# Altium schematic sheet Sch_TrackCommanderCar_PowerPart.SchDoc
size 457 x 254 mm; SheetNumber: 1; SheetTotal: 3
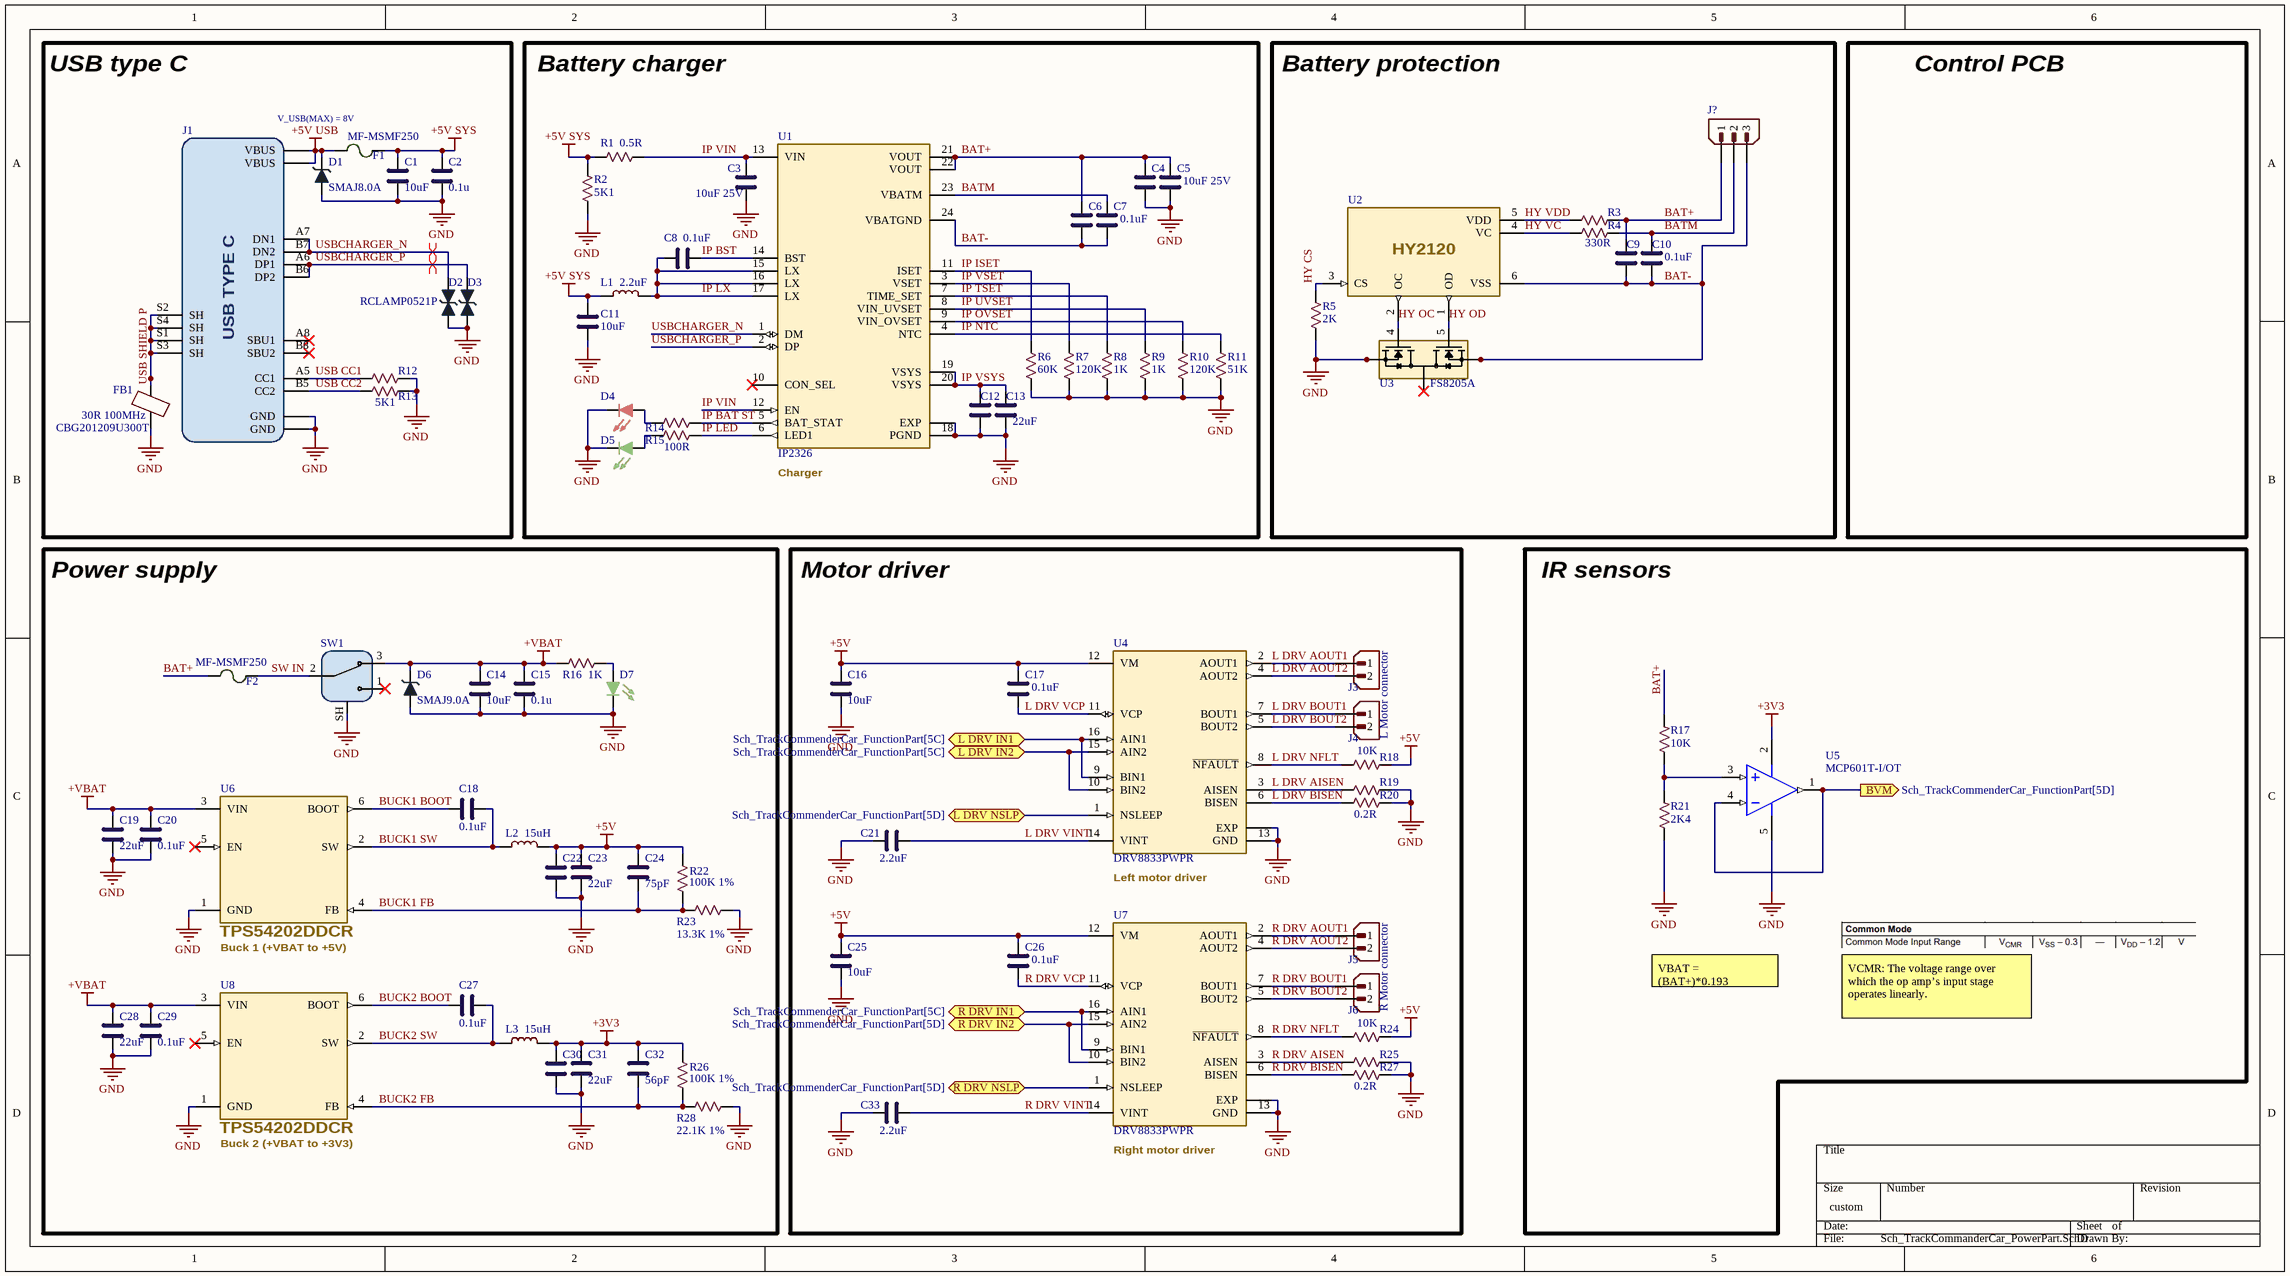
[diagram p0: Sch_TrackCommanderCar_PowerPart.SchDoc]

## Parts
C1  10uF  [C_1206]
C2  0.1u  [C_1206]
C3  10uF 25V  [C_0805]
C4  10uF 25V  [C_0805]  (value not drawn)
C5  10uF 25V  [C_0805]
C6  0.1uF  [C_0603]  (value not drawn)
C7  0.1uF  [C_0603]
C8  0.1uF  [C_0603]
C9  0.1uF  [C_0603]  (value not drawn)
C10  0.1uF  [C_0603]
C11  10uF  [C_1206]
C12  22uF  [C_0805]  (value not drawn)
C13  22uF  [C_0805]
C14  10uF  [C_1206]
C15  0.1u  [C_1206]
C16  10uF  [C_0805]
C17  0.1uF  [C_0603]
C18  0.1uF  [C_0603]
C19  22uF  [C_1206]
C20  0.1uF  [C_1206]
C21  2.2uF  [C_0805]
C22  22uF  [C_1210]  (value not drawn)
C23  22uF  [C_1210]
C24  75pF  [C_0603]
C25  10uF  [C_0805]
C26  0.1uF  [C_0603]
C27  0.1uF  [C_0603]
C28  22uF  [C_1206]
C29  0.1uF  [C_1206]
C30  22uF  [C_1210]  (value not drawn)
C31  22uF  [C_1210]
C32  56pF  [C_0603]
C33  2.2uF  [C_0805]
D1  SMAJ8.0A  [TVS_SMAJ_XA]
D2  RCLAMP0521P  [TVS_RCLAMP0521P]  (value not drawn)
D3  RCLAMP0521P  [TVS_RCLAMP0521P]
D4  Led_Red  [Led_0603]  (value not drawn)
D5  Led_Green  [Led_0603]  (value not drawn)
D6  SMAJ9.0A  [TVS_SMAJ_XA]
D7  Led_Green  [Led_0603]  (value not drawn)
F1  MF-MSMF250  [Fuse1812]
F2  MF-MSMF250  [Fuse1812]
FB1  30R 100MHz  [Ferrite bead 0805]
J1  USB TYPE C  [USB_C_16Pin]
J3  L Motor connector  [JST PH_2_2.0]  (value not drawn)
J4  L Motor connector  [JST PH_2_2.0]
J5  R Motor connector  [JST PH_2_2.0]  (value not drawn)
J6  R Motor connector  [JST PH_2_2.0]
J?  JST XH_3_2.5  [JST XH_3_2.5]  (value not drawn)
L1  2.2uF  [INDUCTOR 1040]
L2  15uH  [INDUCTOR 1040]
L3  15uH  [INDUCTOR 1040]
R1  0.5R  [R_0603]
R2  5K1  [R_0603]
R3  330R  [R_0805]  (value not drawn)
R4  330R  [R_0805]
R5  2K  [R_0805]
R6  60K  [R_0603]
R7  120K  [R_0603]
R8  1K  [R_0603]
R9  1K  [R_0603]
R10  120K  [R_0603]
R11  51K  [R_0603]
R12  5K1  [R_0603]  (value not drawn)
R13  5K1  [R_0603]
R14  100R  [R_0603]  (value not drawn)
R15  100R  [R_0603]
R16  1K  [R_0603]
R17  10K  [R_0603]
R18  10K  [R_0603]
R19  0.2R  [R_0805]  (value not drawn)
R20  0.2R  [R_0805]
R21  2K4  [R_0603]
R22  100K 1%  [R_0603]
R23  13.3K 1%  [R_0603]
R24  10K  [R_0603]
R25  0.2R  [R_0805]  (value not drawn)
R26  100K 1%  [R_0603]
R27  0.2R  [R_0805]
R28  22.1K 1%  [R_0603]
SW1  SSW  [Slide_SW_SS12F23G4]  (value not drawn)
U1  IP2326  [IP2326_QFN_24]
U2  HY2120  [HY2120]
U3  FS8205A  [FS8205A]
U4  DRV8833PWPR  [DRV8833PWPR]
U5  MCP601T-I/OT  [SOT23_OPAMP]
U6  TPS54202DDCR  [TPS54202DDCR]
U7  DRV8833PWPR  [DRV8833PWPR]
U8  TPS54202DDCR  [TPS54202DDCR]

## Blocks framed on the sheet
CBG201209U300T: C1 C2 D1-D3 F1 FB1 J1 R12 R13
Charger: C3-C8 C11-C13 D4 D5 L1 R1 R2 R6-R11 R14 R15 U1

## Ports
BVM (out, see Sch_TrackCommenderCar_FunctionPart[5D]), L DRV IN1 (bidir, see Sch_TrackCommenderCar_FunctionPart[5C]), L DRV IN2 (bidir, see Sch_TrackCommenderCar_FunctionPart[5C]), L DRV NSLP (bidir, see Sch_TrackCommenderCar_FunctionPart[5D]), R DRV IN1 (bidir, see Sch_TrackCommenderCar_FunctionPart[5C]), R DRV IN2 (bidir, see Sch_TrackCommenderCar_FunctionPart[5D]), R DRV NSLP (bidir, see Sch_TrackCommenderCar_FunctionPart[5D])

## Nets
+3V3: C30.2 C31.1 C32.1 L3.2 R26.1 U5.2(VSS)
+5V: C16.2 C17.2 C22.2 C23.1 C24.1 C25.2 C26.2 L2.2 R18.2 R22.1 R24.2 U4.12(VM) U7.12(VM)
+5V SYS: C1.2 C2.2 C11.2 F1.2 L1.1 R1.2 R2.1
+5V USB: D1.1(C) F1.1 J1.A4_B9(VBUS) J1.B4_A9(VBUS)
+VBAT: C14.2 C15.2 C19.2 C20.2 C28.2 C29.2 D6.1(C) R16.2 SW1.3 U6.3(VIN) U8.3(VIN)
GND: C1.1 C2.1 C3.1 C4.1 C5.1 C11.1 C12.1 C13.1 C14.1 C15.1 C16.1 C19.1 C20.1 C21.2 C22.1 C23.2 C25.1 C28.1 C29.1 C30.1 C31.2 C33.2 D1.2(A) D2.1 D3.1 D4.1(K) D5.1(K) D6.2(A) D7.1(K) FB1.1 J1.A1_B12(GND) J1.B1_A12(GND) R2.2 R5.1 R6.1 R7.1 R8.1 R9.1 R10.1 R11.1 R12.1 R13.1 R19.2 R20.2 R21.1 R23.1 R25.2 R27.2 R28.1 SW1.SH U1.18(PGND) U1.GND(EXP) U3.2(S1) U3.3(S1) U4.13(GND) U4.GND(EXP) U5.5(VDD) U6.1(GND) U7.13(GND) U7.GND(EXP) U8.1(GND)
BAT+: C4.2 C5.2 C6.2 C9.2 F2.1 J?.1 R3.2 R17.2 U1.21(VOUT) U1.22(VOUT)
BAT-: C6.1 C7.1 C9.1 C10.1 J?.3 U1.24(VBATGND) U2.6(VSS) U3.6(S2) U3.7(S2)
BATM: C7.2 C10.2 J?.2 R4.2 U1.23(VBATM)
BUCK1 BOOT: C18.2 U6.6(BOOT)
BUCK1 FB: C24.2 R22.2 R23.2 U6.4(FB)
BUCK1 SW: C18.1 L2.1 U6.2(SW)
BUCK2 BOOT: C27.2 U8.6(BOOT)
BUCK2 FB: C32.2 R26.2 R28.2 U8.4(FB)
BUCK2 SW: C27.1 L3.1 U8.2(SW)
BVM: U5.1(VOUT) U5.4(VIN-) ; port BVM
HY CS: R5.2 U2.3(CS)
HY OC: U2.2(OC) U3.4(G1)
HY OD: U2.1(OD) U3.5(G2)
HY VC: R4.1 U2.4(VC)
HY VDD: R3.1 U2.5(VDD)
IP BAT ST: R14.1 U1.5(BAT_STAT)
IP BST: C8.1 U1.14(BST)
IP ISET: R6.2 U1.11(ISET)
IP LED: R15.1 U1.6(LED1)
IP LX: C8.2 L1.2 U1.15(LX) U1.16(LX) U1.17(LX)
IP NTC: R11.2 U1.4(NTC)
IP OVSET: R10.2 U1.9(VIN_OVSET)
IP TSET: R8.2 U1.7(TIME_SET)
IP UVSET: R9.2 U1.8(VIN_UVSET)
IP VIN: C3.2 R1.1 U1.12(EN) U1.13(VIN)
IP VSET: R7.2 U1.3(VSET)
IP VSYS: C12.2 C13.2 U1.19(VSYS) U1.20(VSYS)
L DRV AISEN: R19.1 U4.3(AISEN)
L DRV AOUT1: J3.1 U4.2(AOUT1)
L DRV AOUT2: J3.2 U4.4(AOUT2)
L DRV BISEN: R20.1 U4.6(BISEN)
L DRV BOUT1: J4.1 U4.7(BOUT1)
L DRV BOUT2: J4.2 U4.5(BOUT2)
L DRV IN1: U4.9(BIN1) U4.16(AIN1) ; port L DRV IN1
L DRV IN2: U4.10(BIN2) U4.15(AIN2) ; port L DRV IN2
L DRV NFLT: R18.1 U4.8(~{NFAULT})
L DRV NSLP: U4.1(NSLEEP) ; port L DRV NSLP
L DRV VCP: C17.1 U4.11(VCP)
L DRV VINT: C21.1 U4.14(VINT)
R DRV AISEN: R25.1 U7.3(AISEN)
R DRV AOUT1: J5.1 U7.2(AOUT1)
R DRV AOUT2: J5.2 U7.4(AOUT2)
R DRV BISEN: R27.1 U7.6(BISEN)
R DRV BOUT1: J6.1 U7.7(BOUT1)
R DRV BOUT2: J6.2 U7.5(BOUT2)
R DRV IN1: U7.9(BIN1) U7.16(AIN1) ; port R DRV IN1
R DRV IN2: U7.10(BIN2) U7.15(AIN2) ; port R DRV IN2
R DRV NFLT: R24.1 U7.8(~{NFAULT})
R DRV NSLP: U7.1(NSLEEP) ; port R DRV NSLP
R DRV VCP: C26.1 U7.11(VCP)
R DRV VINT: C33.1 U7.14(VINT)
SW IN: F2.2 SW1.2
USB CC1: J1.A5(CC1) R12.2
USB CC2: J1.B5(CC2) R13.2
USB SHIELD P: FB1.2 J1.S1(SH) J1.S2(SH) J1.S3(SH) J1.S4(SH)
USBCHARGER_N: D2.2 J1.A7(DN1) J1.B7(DN2) U1.1(DM)
USBCHARGER_P: D3.2 J1.A6(DP1) J1.B6(DP2) U1.2(DP)
NetD4_2: D4.2(A) R14.2
NetD5_2: D5.2(A) R15.2
NetD7_2: D7.2(A) R16.1
NetR17_1: R17.1 R21.2 U5.3(VIN+)
NetU3_1: U3.1(D12) U3.8(D12)

Not connected (* = marked no-connect by the designer): J1 A8(SBU1)* B8(SBU2)*; SW1 1*; U1 10(CON_SEL)*; U6 5(EN)*; U8 5(EN)*

## Layout directives
differential pair: USBCHARGER_N, USBCHARGER_P

## Notes on the sheet
- USB type C
- Battery charger
- Battery protection
- Control PCB connector
- V_USB(MAX) = 8V
- Power supply
- Motor driver
- IR sensors
- Left motor driver
- Buck 1 (+VBAT to +5V)
- VBAT = (BAT+)*0.193
- VCMR: The voltage range over which the op amp’s input stage operates linearly.
- (near U8) Buck 2 (+VBAT to +3V3)
- (near U7) Right motor driver

## Library data of the parts
C1 C2 C11 C14 C15 C19 C20 C28 C29 = C1206
C3-C5 C12 C13 C16 C21 C25 C33 = C0805
C6-C10 C17 C18 C24 C26 C27 C32 = C0603
C22 C23 C30 C31 = C1210
D1 D6 = TVS_SMAJ_XA
D2 D3 = TVS_RCLAMP0521P
F1 F2 = Fuse1812
FB1 = Ferrite Bead 0805
J1 = USB_C: 16_PIN
J3-J6 = JST PH_2_2.0
L1-L3 = INDUCTOR_1040
R1 R2 R6-R18 R21-R24 R26 R28 = R0603
R3-R5 R19 R20 R25 R27 = R0805
U2 = HY2120: Battery protection
U3 = FS8205A: Back to back MOSFET
U4 U7 = DRV8833PWPR: Dual H-Bridge Motor Driver
U5 = MCP601T-I/OT: Op Amp Single Low Power Amplifier R-R O/P 6V Automotive 5-Pin SOT-23 T/R; Manufacturer: Microchip; Bandwidth: 2.8MHz; Common Mode Rejection Ratio: 75dB; Input Bias Current: 60pA; Input Offset Voltage (Vos): 2mV; Max Output Current: 30mA; Max Supply Current: 2mA; Min Supply Voltage: 2.7V; Nominal Supply Current: 230µA; Number of Amplifiers: 1; Operating Supply Voltage: 5.5V; Output Current: 22mA; Power Supply Rejection Ratio (PSRR): 80dB; Settling Time: 4.5µs; Slew Rate: 2.3V/µs; Voltage: 5V; Voltage Gain: 115dB; Supplier 1: Arrow Electronics; Manufacturer Part Number: MCP601T-I/OT; RoHS: Compliant; Category: Amplifiers - Op Amps, Buffer, Instrumentation; Stock 1: 12000; Pricing 1: 3000=0.4064 (USD); Projected EOL Date: 2034-01-01; Case/Package: SOT-23; Country of Assembly: Malaysia, Thailand; Country of Fabrication: United States of America; Country of Origin: Malaysia, Thailand; Export Control Classification Number (ECCN) Code: EAR99; Gain Bandwidth Product: 2.8MHz; Height: 1.3mm; Harmonized Tariff Schedule (HTS) Code: 8542.33.0001; Introduction Date: 2002-01-01; Lead Free: Lead Free; Length: 3.1mm; Lifecycle Status: Production; Max Operating Temperature: 85°C; Max Supply Voltage: 6V; Min Operating Temperature: -40°C; Mount: Surface Mount; Number of Channels: 1; Number of Circuits: 1; Number of Elements: 1; Number of Pins: 5; Packaging: Cut Tape; Radiation Hardening: No; REACH SVHC: No; Schedule B: 8542330000, 8542330000|8542330000|8542330000|8542330000|8542330000; Width: 1.8mm; ComponentLink1URL: https://datasheet.octopart.com:443/MCP601T-I/OT-Microchip-datasheet-8327811.pdf?src-supplier=Augswan; ComponentLink1Description: https://datasheet.octopart.com:443/MCP601T-I/OT-Microchip-datasheet-8327811.pdf?src-supplier=Augswan; ComponentLink2URL: https://datasheet.octopart.com:443/MCP601T-I/OT-Microchip-datasheet-7869.pdf?src-supplier=element14; ComponentLink2Description: https://datasheet.octopart.com:443/MCP601T-I/OT-Microchip-datasheet-7869.pdf?src-supplier=element14; ComponentLink3URL: https://datasheet.octopart.com:443/MCP601T-I-OT-Microchip-datasheet-170283493.pdf?src-supplier=Microchip; ComponentLink3Description: https://datasheet.octopart.com:443/MCP601T-I-OT-Microchip-datasheet-170283493.pdf?src-supplier=Microchip; ComponentLink4URL: https://datasheet.octopart.com:443/MCP601T-I-OT-Microchip-datasheet-158592061.pdf?src-supplier=SHENGYU+ELECTRONICS; ComponentLink4Description: https://datasheet.octopart.com:443/MCP601T-I-OT-Microchip-datasheet-158592061.pdf?src-supplier=SHENGYU+ELECTRONICS; ComponentLink5URL: https://datasheet.octopart.com:443/MCP601T-I/OT-Microchip-datasheet-9917688.pdf?src-supplier=RS+(Formerly+Allied+Electronics); ComponentLink5Description: https://datasheet.octopart.com:443/MCP601T-I/OT-Microchip-datasheet-9917688.pdf?src-supplier=RS+(Formerly+Allied+Electronics); ComponentLink6URL: https://datasheet.octopart.com:443/MCP601T-I-OT-Microchip-datasheet-140568181.pdf?src-supplier=Arrow.cn; ComponentLink6Description: https://datasheet.octopart.com:443/MCP601T-I-OT-Microchip-datasheet-140568181.pdf?src-supplier=Arrow.cn; ComponentLink7URL: http://sigma.octopart.com:80/188449423/materials_sheet/Microchip-MCP601T-I-OT.pdf?src-supplier=Compliance+Statements; ComponentLink7Description: http://sigma.octopart.com:80/188449423/materials_sheet/Microchip-MCP601T-I-OT.pdf?src-supplier=Compliance+Statements; ComponentLink8URL: http://sigma.octopart.com:80/conflict_mineral_statement/Microchip-company-68.pdf?src-supplier=Compliance+Statements; ComponentLink8Description: http://sigma.octopart.com:80/conflict_mineral_statement/Microchip-company-68.pdf?src-supplier=Compliance+Statements; ComponentLink9URL: http://sigma.octopart.com:80/conflict_mineral_statement/Microchip-company-69.pdf?src-supplier=Compliance+Statements; ComponentLink9Description: http://sigma.octopart.com:80/conflict_mineral_statement/Microchip-company-69.pdf?src-supplier=Compliance+Statements; ComponentLink10URL: http://sigma.octopart.com:80/reach_statement/Microchip-company-70.pdf?src-supplier=Compliance+Statements; ComponentLink10Description: http://sigma.octopart.com:80/reach_statement/Microchip-company-70.pdf?src-supplier=Compliance+Statements; ComponentLink11URL: http://sigma.octopart.com:80/rohs_statement/Microchip-company-71.pdf?src-supplier=Compliance+Statements; ComponentLink11Description: http://sigma.octopart.com:80/rohs_statement/Microchip-company-71.pdf?src-supplier=Compliance+Statements; Supplier Part Number 1: MCP601T-I/OT